# Altium schematic sheet [2]isoSPI.SchDoc
size A4; SheetNumber: 1; SheetTotal: 2
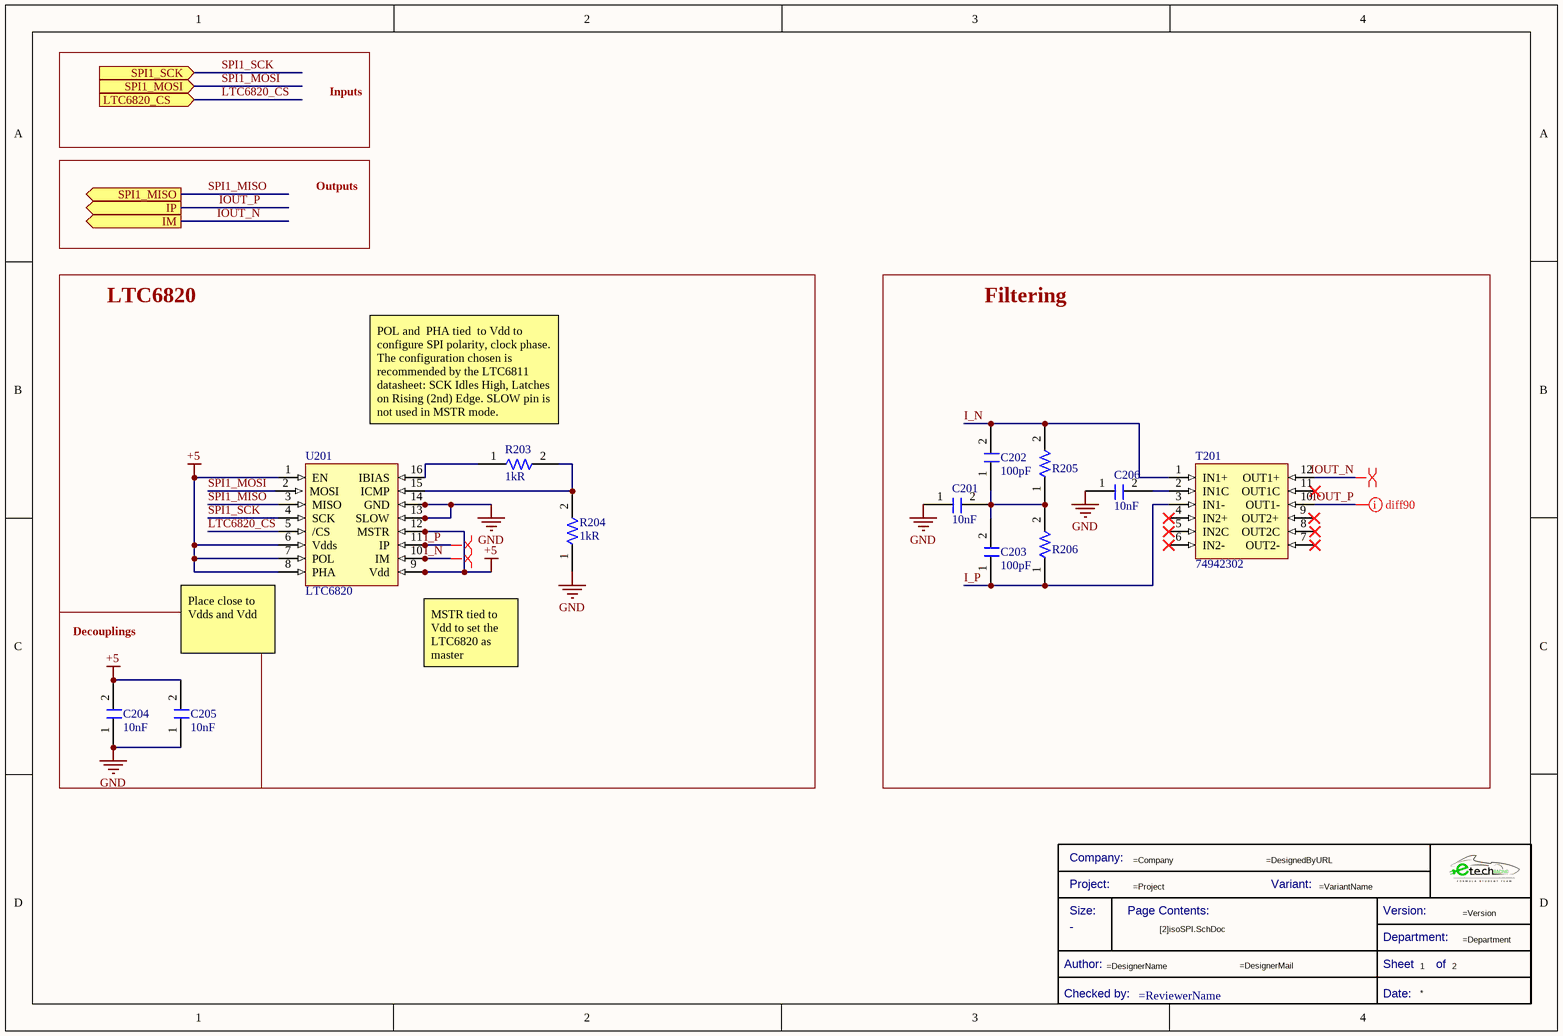
[diagram p0: [2]isoSPI.SchDoc]

## Parts
*  Title Block_template  (value not drawn)  (graphical)
C201  Capacitance: 10nF  [C1206FNPC-RW]  (hidden comment: 885012008055)
C202  Capacitance: 100pF  [C0805FNPC-W]  (hidden comment: 885012007057)
C203  Capacitance: 100pF  [C0805FNPC-W]  (hidden comment: 885012007057)
C204  Capacitance: 10nF  [C0805FNPC-R]  (hidden comment: 885012207092)
C205  Capacitance: 10nF  [C0805FNPC-R]  (hidden comment: 885012207092)
C206  Capacitance: 10nF  [C1206FNPC-RW]  (hidden comment: 885012008055)
R203  Resistance: 1kR  [R0805FTK]  (hidden comment: CR0805-JW-102ELF)
R204  Resistance: 1kR  [R0805FTK]  (hidden comment: CR0805-JW-102ELF)
R205  CRCW080550R0FKTA  [R0805FTK]  (value not drawn)
R206  CRCW080550R0FKTA  [R0805FTK]  (value not drawn)
T201  74942302  [TFMR_74942302]
U201  LTC6820  [LTC6820]

## Blocks framed on the sheet
LTC6820: R203 R204 U201
Filtering: C201-C203 C206 R205 R206 T201
Decouplings: C204 C205

## Ports
IM (out), IP (out), LTC6820_CS (in), SPI1_MISO (out), SPI1_MOSI (in), SPI1_SCK (in)

## Nets
+5: C204.2 C205.2 U201.1(EN) U201.6(Vdds) U201.7(POL) U201.8(PHA) U201.9(Vdd) U201.12(MSTR)
GND: C201.1 C204.1 C205.1 C206.1 R204.1 U201.13(SLOW) U201.14(GND)
I_N: C202.2 R205.2 T201.1(IN1+) U201.10(IM)
I_P: C203.1 R206.1 T201.3(IN1-) U201.11(IP)
IOUT_N: T201.12(OUT1+) ; port IM
IOUT_P: T201.10(OUT1-) ; port IP
LTC6820_CS: U201.5(/CS) ; port LTC6820_CS
SPI1_MISO: U201.3(MISO) ; port SPI1_MISO
SPI1_MOSI: U201.2(MOSI) ; port SPI1_MOSI
SPI1_SCK: U201.4(SCK) ; port SPI1_SCK
NetC201_2: C201.2 C202.1 C203.2 R205.1 R206.2
NetC206_2: C206.2 T201.2(IN1C)
NetR203_1: R203.1 U201.16(IBIAS)
NetR203_2: R203.2 R204.2 U201.15(ICMP)

Not connected (* = marked no-connect by the designer): T201 4(IN2+)* 5(IN2C)* 6(IN2-)* 7(OUT2-)* 8(OUT2C)* 9(OUT2+)* 11(OUT1C)*

## Layout directives
differential pair: I_N, I_P, IOUT_P
differential pair; differential pair class DIFF90: IOUT_N

## Notes on the sheet
- Inputs
- Outputs
- POL and  PHA tied  to Vdd to configure SPI polarity, clock phase.
  The configuration chosen is recommended by the LTC6811 datasheet: SCK Idles High, Latches on Rising (2nd) Edge. SLOW pin is not used in MSTR mode.
- (near U201) Place close to Vdds and Vdd
- (near U201) MSTR tied to Vdd to set the LTC6820 as master
- (in symbol Title Block_template) Company:; Project:; Variant:; Size:; Page Contents:; Version:; Department:; Author:; Sheet; of; Checked by:; Date:

## Library data of the parts
* = Title Block_template: Standard Title Block; .Creator: GP; Category: Title Block; .PCBcheck: GP; .SCHcheck: GP; Checked by:: =ReviewerName; Size: -
C201 C206 = C10n-50V-1206FNPC-C0G/NP0: Cap Cer 10000PF 50V C0G/NP0 1206; Manufacturer: Wurth Electronics; Tolerance: 5%; .Creator: DO; Supplier 1: Mouser; Manufacturer Part Number: 885012008055; RoHS: Yes; Category: Ceramic Capacitors; Stock 1: 4648; Pricing 1: 1=0,40000, 10=0,35800, 50=0,35800, 100=0,32100, 1000=0,28400, 10000=0,17200 (USD); Mount: Surface Mount; Case/Package: 1206; Case Code (Metric): 3216; Case Code (Imperial): 1206; Min Operating Temperature: -55°C; Max Operating Temperature: 125°C; Packaging: Tape and Reel; Voltage Rating: 50V; Length: 0.126inch; Width: 0.063inch; Thickness: 0.053inch; ComponentLink1URL: https://katalog.we-online.de/pbs/datasheet/885012008055.pdf?src-supplier=Digi-Key; ComponentLink1Description: https://katalog.we-online.de/pbs/datasheet/885012008055.pdf?src-supplier=Digi-Key; Supplier Part Number 1: 710-885012008055; ComponentLink2Description: Where buy it; ComponentLink2URL: https://www.we-online.com/catalog/en/WCAP-CSGP-50VDC#885012207092
C202 C203 = C100p-50V-0805FNPC-C0G/NP0: Multilayer Ceramic Capacitor, Wcap-Csgp Series, 100 Pf, 5%, C0G / Np0, 50 V, 0805 [2012 Metric] Rohs Compliant: Yes; Manufacturer: Wurth Electronics; Voltage Rating: 50V; .Creator: DR; Supplier 1: RSComponents; Manufacturer Part Number: 885012007057; RoHS: Yes; Category: Ceramic Capacitors; Stock 1: 1; Pricing 1: 4000=0,03900, 12000=0,03800 (USD); Mount: Surface Mount; Case/Package: 0805; Case Code (Metric): 2012; Case Code (Imperial): 0805; Min Operating Temperature: -55°C; Max Operating Temperature: 125°C; Packaging: Cut Tape; Dielectric: C0G; Tolerance: 5%; Voltage Rating (DC): 50V; Length: 0.079inch; Width: 0.049inch; Thickness: 0.035inch; REACH SVHC: Unknown; RoHS Compliant: Yes; ComponentLink1URL: http://www.farnell.com/datasheets/1958443.pdf?src-supplier=Farnell; ComponentLink1Description: http://www.farnell.com/datasheets/1958443.pdf?src-supplier=Farnell; ComponentLink2URL: https://katalog.we-online.de/pbs/datasheet/885012007057.pdf?src-supplier=Digi-Key; ComponentLink2Description: https://katalog.we-online.de/pbs/datasheet/885012007057.pdf?src-supplier=Digi-Key; ComponentLink3URL: http://www.farnell.com/datasheets/1958443.pdf?src-supplier=Element14; ComponentLink3Description: http://www.farnell.com/datasheets/1958443.pdf?src-supplier=Element14; ComponentLink4URL: http://www.farnell.com/datasheets/1958443.pdf?src-supplier=Newark; ComponentLink4Description: http://www.farnell.com/datasheets/1958443.pdf?src-supplier=Newark; ComponentLink5Description: Where buy it; ComponentLink5URL: https://www.we-online.com/catalog/en/WCAP-CSGP-50VDC#885012007057; Supplier Part Number 1: 1813930
C204 C205 = C10n-50V-0805FNPC-X7R: Cap, 0.01ΜF, 50V, 10%, X7R, 0805; Manufacturer 1: Wurth Electronics; .Creator: DR; Supplier 1: RSComponents; Manufacturer Part Number 1: 885012207092; RoHS: Yes; Category: Ceramic Capacitors; Stock 1: 1; Pricing 1: 4000=0,03200, 12000=0,03100 (USD); Mount: Surface Mount; Case/Package: 0805; Case Code (Metric): 2012; Case Code (Imperial): 0805; Min Operating Temperature: -55°C; Max Operating Temperature: 125°C; Packaging: Cut Tape; Voltage Rating: 50V; Dielectric: X7R; Tolerance: 10%; Voltage Rating (DC): 50V; Length: 0.079inch; Width: 0.049inch; Thickness: 0.035inch; REACH SVHC: Unknown; RoHS Compliant: Yes; ComponentLink1URL: http://www.farnell.com/datasheets/1958497.pdf?src-supplier=Farnell; ComponentLink1Description: http://www.farnell.com/datasheets/1958497.pdf?src-supplier=Farnell; ComponentLink2URL: http://www.farnell.com/datasheets/1958497.pdf?src-supplier=Element14; ComponentLink2Description: http://www.farnell.com/datasheets/1958497.pdf?src-supplier=Element14; ComponentLink3URL: http://www.farnell.com/datasheets/1958497.pdf?src-supplier=Newark; ComponentLink3Description: http://www.farnell.com/datasheets/1958497.pdf?src-supplier=Newark; ComponentLink4URL: https://katalog.we-online.de/pbs/datasheet/885012207092.pdf?src-supplier=Digi-Key; ComponentLink4Description: https://katalog.we-online.de/pbs/datasheet/885012207092.pdf?src-supplier=Digi-Key; Supplier Part Number 1: 1813941
R203 R204 = R1k-0805FTK: Res Thick Film 0805 1K Ohm 5% 1/8W ±200ppm/°C Molded SMD SMD Paper Tape on Plastic Reel; Manufacturer 1: Bourns; Voltage Rating (DC): 150V; Power Rating: 125mW; .Creator: GP; Supplier 1: Arrow Electronics; Manufacturer Part Number 1: CR0805-JW-102ELF; RoHS: Yes; Category: Chip SMD Resistors; Stock 1: 27510; Pricing 1: 1=0,05930, 10=0,03510, 25=0,01790, 100=0,00800, 250=0,00790, 500=0,00590, 1000=0,00360, 3000=0,00350, 6000=0,00250 (USD); Mount: Surface Mount; Case/Package: 0805; Number of Pins: 2; Contact Plating: Tin; Case Code (Metric): 2012; Case Code (Imperial): 0805; Min Operating Temperature: -55°C; Max Operating Temperature: 155°C; Resistor Type: Thick Film; Tolerance: 5%; Temperature Coefficient: 200ppm/°C; Features: Moisture Resistant; Package Quantity: 1; Packaging: Tape and Reel; Voltage Rating: 150V; Number of Terminations: 2; Termination: SMD/SMT; Max Power Dissipation: 125mW; Length: 2mm; Width: 1.25mm; Height: 0.5mm; Thickness: 508um; Depth: 1.25mm; Radiation Hardening: No; Lead Free: Lead Free; REACH SVHC: No SVHC; Military Standard: Not; ComponentLink1URL: https://datasheet.ciiva.com/11821/0900766b80fcdb72-11821134.pdf?src-supplier=RSComponents; ComponentLink1Description: https://datasheet.ciiva.com/11821/0900766b80fcdb72-11821134.pdf?src-supplier=RSComponents; ComponentLink2URL: https://datasheet.ciiva.com/15225/getdatasheetpartid-78155-15225381.pdf?src-supplier=Verical; ComponentLink2Description: https://datasheet.ciiva.com/15225/getdatasheetpartid-78155-15225381.pdf?src-supplier=Verical; ComponentLink3URL: https://datasheet.ciiva.com/22693/1902866-22693253.pdf?src-supplier=Element14; ComponentLink3Description: https://datasheet.ciiva.com/22693/1902866-22693253.pdf?src-supplier=Element14; ComponentLink4URL: https://datasheet.ciiva.com/7986/1856384-7986184.pdf?src-supplier=Element14; ComponentLink4Description: https://datasheet.ciiva.com/7986/1856384-7986184.pdf?src-supplier=Element14; ComponentLink5URL: https://datasheet.ciiva.com/7985/1856384-7985867.pdf?src-supplier=Element14; ComponentLink5Description: https://datasheet.ciiva.com/7985/1856384-7985867.pdf?src-supplier=Element14; ComponentLink6URL: https://datasheet.ciiva.com/30242/159chpreztr-30242765.pdf?src-supplier=Onlinecomponents.com; ComponentLink6Description: https://datasheet.ciiva.com/30242/159chpreztr-30242765.pdf?src-supplier=Onlinecomponents.com; ComponentLink7URL: https://datasheet.ciiva.com/6547/chpreztr-6547359.pdf?src-supplier=Digi-Key; ComponentLink7Description: https://datasheet.ciiva.com/6547/chpreztr-6547359.pdf?src-supplier=Digi-Key; Supplier Part Number 1: CR0805-JW-102ELF
R205 R206 = R50-0805FTK: Res Thick Film 0805 50 Ohm 1% 0.125W(1/8W) ±100ppm/C Pad SMD Automotive T/R; Manufacturer: Vishay Dale; Value: 50R; Power Rating: 125mW; Voltage Rating: 150V; Temperature Coefficient: 100ppm/°C; Supplier 1: Mouser; Manufacturer Part Number: CRCW080550R0FKTA; RoHS: No; Category: Chip SMD Resistors; Stock 1: 38245; Pricing 1: 1=0,25, 10=0,204, 50=0,204, 100=0,08, 1000=0,033, 10000=0,026 (USD); Case/Package: 0805; Weight: 0.000194oz; Case Code (Imperial): 0805; Case Code (Metric): 2012; Contact Plating: Tin,Lead; Min Operating Temperature: -55°C; Max Operating Temperature: 155°C; Tolerance: 1%; Packaging: Tape and Reel; Package Quantity: 5000; Series: CRCW; Length: 2mm; Width: 1.25mm; Height: 0.45mm; Lead Free: Contains Lead; RoHS Compliant: No; ComponentLink1URL: https://datasheet.ciiva.com/48525/dcrcw-48525895.pdf?src-supplier=Avnet; ComponentLink1Description: https://datasheet.ciiva.com/48525/dcrcw-48525895.pdf?src-supplier=Avnet; Supplier Part Number 1: 71-CRCW0805-50
T201 = TFMR_4300V_1min_74942302
U201 = U_LTC6820: IC COMM INTERFACE ISOSPI 16MSOP; Manufacturer: Analog Devices / Linear Technology; Manufacturer Part Number: LTC6820HMS#PBF; Interface: SPI; Min Supply Voltage: 2.7V; Max Supply Voltage: 5.5V; Supplier 1: Mouser; RoHS: Yes; Category: Interface ICs; Stock 1: 5128; Pricing 1: 1=7,42, 10=6,7, 50=6,39, 100=6,39, 1000=4,83, 10000=4,21 (USD); Case/Package: MSOP; Pins: 16; Min Operating Temperature: -40°C; Max Operating Temperature: 125°C; Package Quantity: 37; Packaging: Rail/Tube; Series: isoSPI; Reach SVHC Compliant: No; RoHS Compliant: Yes; ComponentLink1URL: https://datasheet.ciiva.com/22649/1730562-22649441.pdf?src-supplier=Element14; ComponentLink1Description: https://datasheet.ciiva.com/22649/1730562-22649441.pdf?src-supplier=Element14; ComponentLink2URL: https://datasheet.ciiva.com/22767/1730562-22767675.pdf?src-supplier=Farnell; ComponentLink2Description: https://datasheet.ciiva.com/22767/1730562-22767675.pdf?src-supplier=Farnell; ComponentLink3URL: https://datasheet.ciiva.com/6573/42317-6573703.pdf?src-supplier=Digikey; ComponentLink3Description: https://datasheet.ciiva.com/6573/42317-6573703.pdf?src-supplier=Digikey; Supplier Part Number 1: 584-LTC6820HMS#PBF